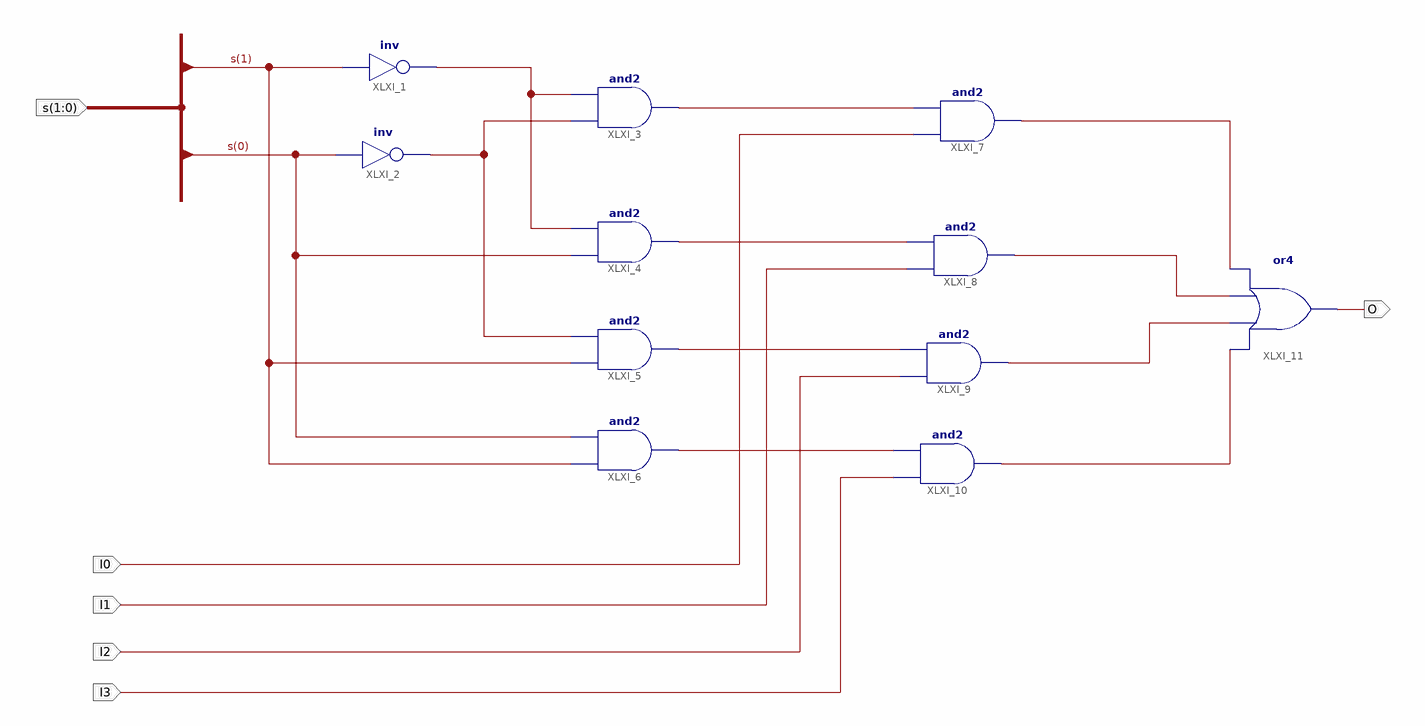
[diagram p0: schematic sheet 1]
// Xilinx ISE schematic MUX4to1.sch (kintex7) as structural Verilog: 11 symbols, 6 ports
module MUX4to1 (
  input  [1:0] s,
  input  I0,
  input  I1,
  input  I2,
  input  I3,
  output O
);

  wire XLXN_4, XLXN_5, XLXN_7, XLXN_9, XLXN_11, XLXN_13, XLXN_15, XLXN_16, XLXN_17, XLXN_18;

  not XLXI_1 (XLXN_4, s[1]);
  not XLXI_2 (XLXN_5, s[0]);
  and XLXI_3 (XLXN_7, XLXN_5, XLXN_4);
  and XLXI_4 (XLXN_9, s[0], XLXN_4);
  and XLXI_5 (XLXN_11, s[1], XLXN_5);
  and XLXI_6 (XLXN_13, s[1], s[0]);
  and XLXI_7 (XLXN_15, I0, XLXN_7);
  and XLXI_8 (XLXN_18, I1, XLXN_9);
  and XLXI_9 (XLXN_17, I2, XLXN_11);
  and XLXI_10 (XLXN_16, I3, XLXN_13);
  or XLXI_11 (O, XLXN_16, XLXN_17, XLXN_18, XLXN_15);
endmodule
